# Altium schematic sheet sptArbiterX2.SCHDOC: LiveDesign Evaluation - Video Games
size A; PART_NAME: xc2s200epq208-5; Organization: Altium Limited; Address1: L3, 12a Rodborough Rd; Address2: Frenchs Forest; Address3: NSW; Address4: Australia 2086; DocumentNumber: 11; SheetNumber: 11; SheetTotal: 11
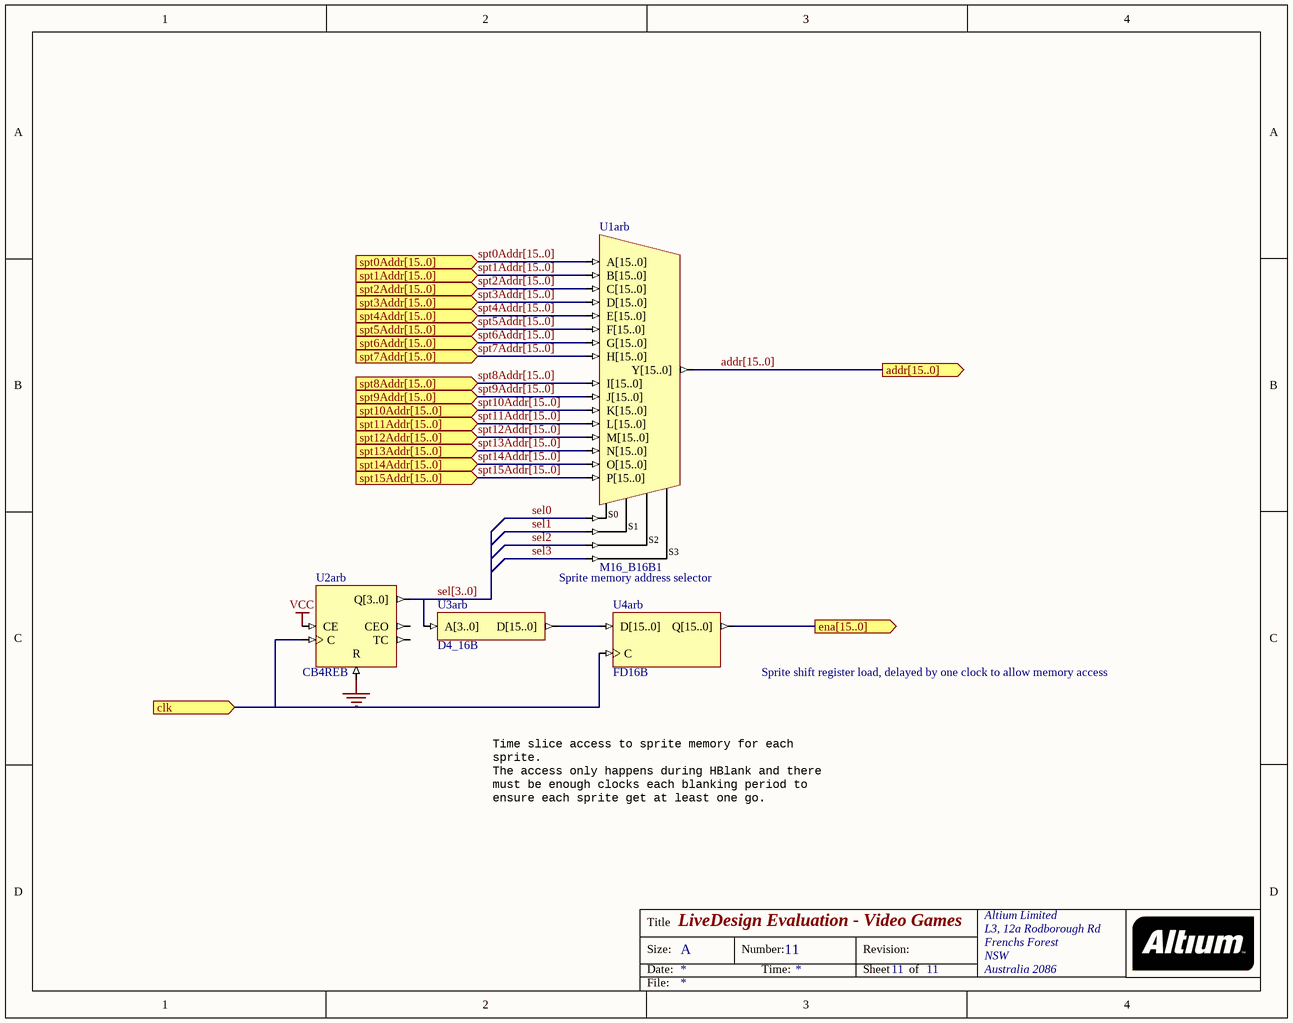
[diagram p0: sptArbiterX2.SCHDOC]

## Parts
U1arb  M16_B16B1
U2arb  CB4REB
U3arb  D4_16B
U4arb  FD16B

## Ports
addr[15..0] (out), clk (in), ena[15..0] (out), spt0Addr[15..0] (in), spt1Addr[15..0] (in), spt2Addr[15..0] (in), spt3Addr[15..0] (in), spt4Addr[15..0] (in), spt5Addr[15..0] (in), spt6Addr[15..0] (in), spt7Addr[15..0] (in), spt8Addr[15..0] (in), spt9Addr[15..0] (in), spt10Addr[15..0] (in), spt11Addr[15..0] (in), spt12Addr[15..0] (in), spt13Addr[15..0] (in), spt14Addr[15..0] (in), spt15Addr[15..0] (in)

## Nets
GND: U2arb.R
VCC: U2arb.CE
addr[15..0]: U1arb.Y[15..0] ; port addr[15..0]
clk: U2arb.C U4arb.C ; port clk
ena[15..0]: U4arb.Q[15..0] ; port ena[15..0]
sel0: U1arb.S0
sel1: U1arb.S1
sel2: U1arb.S2
sel3: U1arb.S3
sel[3..0]: U2arb.Q[3..0] U3arb.A[3..0]
spt0Addr[15..0]: U1arb.A[15..0] ; port spt0Addr[15..0]
spt1Addr[15..0]: U1arb.B[15..0] ; port spt1Addr[15..0]
spt2Addr[15..0]: U1arb.C[15..0] ; port spt2Addr[15..0]
spt3Addr[15..0]: U1arb.D[15..0] ; port spt3Addr[15..0]
spt4Addr[15..0]: U1arb.E[15..0] ; port spt4Addr[15..0]
spt5Addr[15..0]: U1arb.F[15..0] ; port spt5Addr[15..0]
spt6Addr[15..0]: U1arb.G[15..0] ; port spt6Addr[15..0]
spt7Addr[15..0]: U1arb.H[15..0] ; port spt7Addr[15..0]
spt8Addr[15..0]: U1arb.I[15..0] ; port spt8Addr[15..0]
spt9Addr[15..0]: U1arb.J[15..0] ; port spt9Addr[15..0]
spt10Addr[15..0]: U1arb.K[15..0] ; port spt10Addr[15..0]
spt11Addr[15..0]: U1arb.L[15..0] ; port spt11Addr[15..0]
spt12Addr[15..0]: U1arb.M[15..0] ; port spt12Addr[15..0]
spt13Addr[15..0]: U1arb.N[15..0] ; port spt13Addr[15..0]
spt14Addr[15..0]: U1arb.O[15..0] ; port spt14Addr[15..0]
spt15Addr[15..0]: U1arb.P[15..0] ; port spt15Addr[15..0]
NetU3arb_D[15..0]: U3arb.D[15..0] U4arb.D[15..0]

Not connected (* = marked no-connect by the designer): U2arb CEO TC

## Buses and harness runs
bus addr[15..0] = port addr[15..0]
bus sel[3..0]
bus spt0Addr[15..0] = port spt0Addr[15..0]
bus spt1Addr[15..0] = port spt1Addr[15..0]
bus spt2Addr[15..0] = port spt2Addr[15..0]
bus spt3Addr[15..0] = port spt3Addr[15..0]
bus spt4Addr[15..0] = port spt4Addr[15..0]
bus spt5Addr[15..0] = port spt5Addr[15..0]
bus spt6Addr[15..0] = port spt6Addr[15..0]
bus spt7Addr[15..0] = port spt7Addr[15..0]
bus spt8Addr[15..0] = port spt8Addr[15..0]
bus spt9Addr[15..0] = port spt9Addr[15..0]
bus spt10Addr[15..0] = port spt10Addr[15..0]
bus spt11Addr[15..0] = port spt11Addr[15..0]
bus spt12Addr[15..0] = port spt12Addr[15..0]
bus spt13Addr[15..0] = port spt13Addr[15..0]
bus spt14Addr[15..0] = port spt14Addr[15..0]
bus spt15Addr[15..0] = port spt15Addr[15..0]

## Notes on the sheet
- (near U1arb) Sprite memory address selector
- (near U4arb) Sprite shift register load, delayed by one clock to allow memory access
- Time slice access to sprite memory for each sprite.
  The access only happens during HBlank and there must be enough clocks each blanking period to ensure each sprite get at least one go.
- Title
- Size:
- Date:
- A
- Number:
- Time:
- Revision:
- Sheet
- of
- File:

## Library data of the parts
U1arb = M16_B16B1: 16x16-Bit Bus to 1x16-Bit Bus Multiplexer; ArchiveName: GENERIC; Published: 7-Nov-2003; Publisher: Altium Limited; Core Revision: 1.00.00
U2arb = CB4REB: 4-Bit Cascadable Binary Counter with Clock Enable and Synchronous Reset, Bus Version; ArchiveName: GENERIC; Published: 18-Dec-2003; Publisher: Altium Limited; Core Revision: 1.00.00
U3arb = D4_16B: Binary 4- to 16-Bit Decoder, Bus Version; ArchiveName: GENERIC; Published: 9-30-2003; Publisher: Altium Limited; Core Revision: 1.00.00
U4arb = FD16B: 16-Bit D-Type Flip-Flop, Bus Version; ArchiveName: GENERIC; Published: 7-Nov-2003; Publisher: Altium Limited; Core Revision: 1.00.00